# Altium schematic sheet ui-jetson-nano.SchDoc
size 420 x 297 mm; SheetNumber: 4; SheetTotal: 14
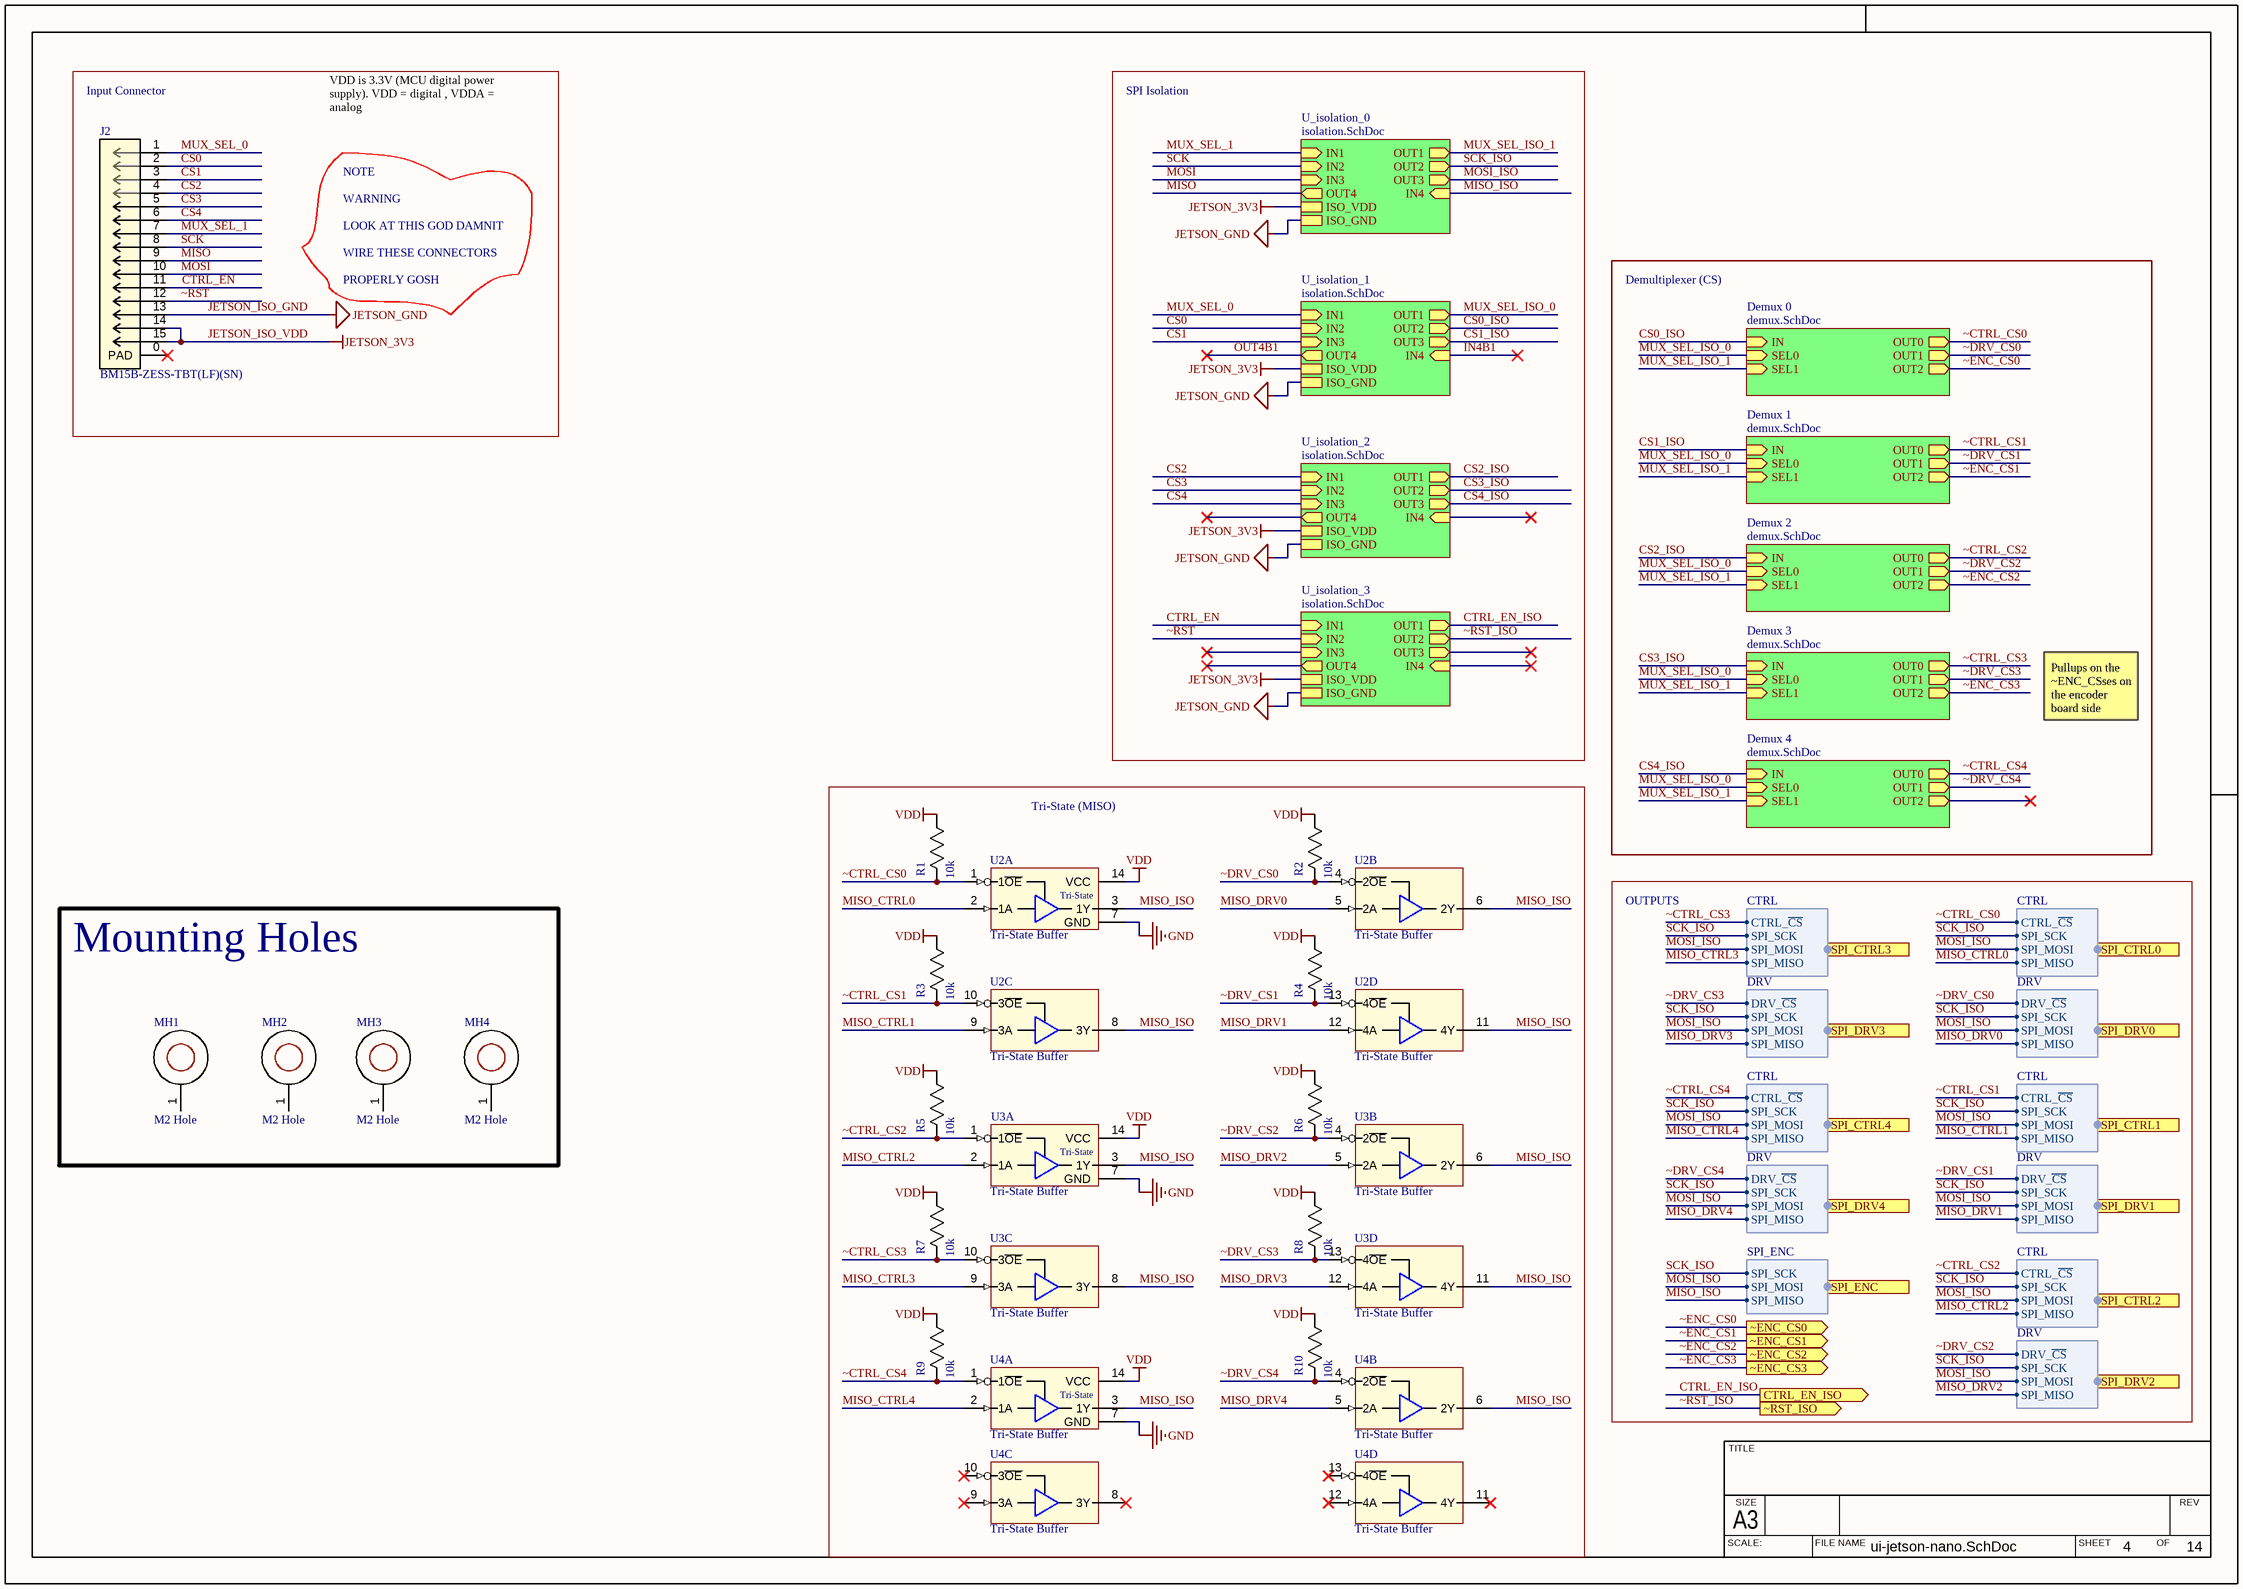
[diagram p0: ui-jetson-nano.SchDoc]

## Parts
J2  BM15B-ZESS-TBT(LF)(SN)  [JST ZE SMT 15POS]
MH1  M2 Hole  [Mounting Hole M2]  (no BOM)
MH2  M2 Hole  [Mounting Hole M2]  (no BOM)
MH3  M2 Hole  [Mounting Hole M2]  (no BOM)
MH4  M2 Hole  [Mounting Hole M2]  (no BOM)
R1  10k  [0603]
R2  10k  [0603]
R3  10k  [0603]
R4  10k  [0603]
R5  10k  [0603]
R6  10k  [0603]
R7  10k  [0603]
R8  10k  [0603]
R9  10k  [0603]
R10  10k  [0603]
U2  Tri-State Buffer  [14-TSSOP]  (parts A,B,C,D of 4)
U3  Tri-State Buffer  [14-TSSOP]  (parts A,B,C,D of 4)
U4  Tri-State Buffer  [14-TSSOP]  (parts A,B,C,D of 4)

## Blocks framed on the sheet
Tri-State (MISO): R1-R10 U2-U4
Mounting Holes: MH1-MH4

## Sub-sheets
Demux 0 = demux.SchDoc: IN (in), SEL0 (in), SEL1 (in), OUT1 (out), OUT2 (out), OUT0 (out)
Demux 1 = demux.SchDoc: IN (in), SEL0 (in), SEL1 (in), OUT1 (out), OUT2 (out), OUT0 (out)
Demux 2 = demux.SchDoc: IN (in), SEL0 (in), SEL1 (in), OUT1 (out), OUT2 (out), OUT0 (out)
Demux 3 = demux.SchDoc: IN (in), SEL0 (in), SEL1 (in), OUT1 (out), OUT2 (out), OUT0 (out)
Demux 4 = demux.SchDoc: IN (in), SEL0 (in), SEL1 (in), OUT1 (out), OUT2 (out), OUT0 (out)
U_isolation_0 = isolation.SchDoc: OUT1 (out), IN1 (in), IN2 (in), IN3 (in), OUT4 (out), OUT3 (out), OUT2 (out), IN4 (in), ISO_VDD, ISO_GND
U_isolation_1 = isolation.SchDoc: OUT1 (out), IN1 (in), IN2 (in), IN3 (in), OUT4 (out), OUT3 (out), OUT2 (out), IN4 (in), ISO_VDD, ISO_GND
U_isolation_2 = isolation.SchDoc: OUT1 (out), IN1 (in), IN2 (in), IN3 (in), OUT4 (out), OUT3 (out), OUT2 (out), IN4 (in), ISO_VDD, ISO_GND
U_isolation_3 = isolation.SchDoc: OUT1 (out), IN1 (in), IN2 (in), IN3 (in), OUT4 (out), OUT3 (out), OUT2 (out), IN4 (in), ISO_VDD, ISO_GND

## Ports
CTRL_EN_ISO (out), SPI_CTRL0 (harness CTRL), SPI_CTRL1 (harness CTRL), SPI_CTRL2 (harness CTRL), SPI_CTRL3 (harness CTRL), SPI_CTRL4 (harness CTRL), SPI_DRV0 (harness DRV), SPI_DRV1 (harness DRV), SPI_DRV2 (harness DRV), SPI_DRV3 (harness DRV), SPI_DRV4 (harness DRV), SPI_ENC (harness SPI_ENC), ~ENC_CS0 (out), ~ENC_CS1 (out), ~ENC_CS2 (out), ~ENC_CS3 (out), ~RST_ISO (out)

## Harnesses
CTRL: SPI_SCK, SPI_MISO, SPI_MOSI, CTRL_~{CS}
DRV: SPI_SCK, SPI_MISO, SPI_MOSI, DRV_~{CS}
SPI_ENC: SPI_SCK, SPI_MISO, SPI_MOSI

## Nets
GND: U2.7(GND) U3.7(GND) U4.7(GND)
JETSON_ISO_GND: J2.13 ; sheet U_isolation_0/ISO_GND, sheet U_isolation_1/ISO_GND, sheet U_isolation_2/ISO_GND, sheet U_isolation_3/ISO_GND  [also labelled JETSON_GND]
JETSON_ISO_VDD: J2.14 J2.15 ; sheet U_isolation_0/ISO_VDD, sheet U_isolation_1/ISO_VDD, sheet U_isolation_2/ISO_VDD, sheet U_isolation_3/ISO_VDD  [also labelled JETSON_3V3]
VDD: R1.1(R1) R2.1(R1) R3.1(R1) R4.1(R1) R5.1(R1) R6.1(R1) R7.1(R1) R8.1(R1) R9.1(R1) R10.1(R1) U2.14(VCC) U3.14(VCC) U4.14(VCC)
CS0: J2.2 ; sheet U_isolation_1/IN2
CS0_ISO: sheet U_isolation_1/OUT2, sheet Demux 0/IN
CS1: J2.3 ; sheet U_isolation_1/IN3
CS1_ISO: sheet U_isolation_1/OUT3, sheet Demux 1/IN
CS2: J2.4 ; sheet U_isolation_2/IN1
CS2_ISO: sheet U_isolation_2/OUT1, sheet Demux 2/IN
CS3: J2.5 ; sheet U_isolation_2/IN2
CS3_ISO: sheet U_isolation_2/OUT2, sheet Demux 3/IN
CS4: J2.6 ; sheet U_isolation_2/IN3
CS4_ISO: sheet U_isolation_2/OUT3, sheet Demux 4/IN
CTRL_EN: J2.11 ; sheet U_isolation_3/IN1
CTRL_EN_ISO: port CTRL_EN_ISO, sheet U_isolation_3/OUT1
IN4B1: sheet U_isolation_1/IN4
MISO: J2.9 ; sheet U_isolation_0/OUT4
MISO_CTRL0: U2.2(1A) ; port SPI_CTRL0.SPI_MISO
MISO_CTRL1: U2.9(3A) ; port SPI_CTRL1.SPI_MISO
MISO_CTRL2: U3.2(1A) ; port SPI_CTRL2.SPI_MISO
MISO_CTRL3: U3.9(3A) ; port SPI_CTRL3.SPI_MISO
MISO_CTRL4: U4.2(1A) ; port SPI_CTRL4.SPI_MISO
MISO_DRV0: U2.5(2A) ; port SPI_DRV0.SPI_MISO
MISO_DRV1: U2.12(4A) ; port SPI_DRV1.SPI_MISO
MISO_DRV2: U3.5(2A) ; port SPI_DRV2.SPI_MISO
MISO_DRV3: U3.12(4A) ; port SPI_DRV3.SPI_MISO
MISO_DRV4: U4.5(2A) ; port SPI_DRV4.SPI_MISO
MISO_ISO: U2.3(1Y) U2.6(2Y) U2.8(3Y) U2.11(4Y) U3.3(1Y) U3.6(2Y) U3.8(3Y) U3.11(4Y) U4.3(1Y) U4.6(2Y) ; sheet U_isolation_0/IN4, port SPI_ENC.SPI_MISO
MOSI: J2.10 ; sheet U_isolation_0/IN3
MOSI_ISO: sheet U_isolation_0/OUT3, port SPI_CTRL0.SPI_MOSI, port SPI_DRV0.SPI_MOSI, port SPI_ENC.SPI_MOSI, port SPI_CTRL1.SPI_MOSI, port SPI_DRV1.SPI_MOSI, port SPI_CTRL2.SPI_MOSI, port SPI_DRV2.SPI_MOSI, port SPI_CTRL3.SPI_MOSI, port SPI_DRV3.SPI_MOSI, port SPI_CTRL4.SPI_MOSI, port SPI_DRV4.SPI_MOSI
MUX_SEL_0: J2.1 ; sheet U_isolation_1/IN1
MUX_SEL_1: J2.7 ; sheet U_isolation_0/IN1
MUX_SEL_ISO_0: sheet U_isolation_1/OUT1, sheet Demux 0/SEL0, sheet Demux 1/SEL0, sheet Demux 2/SEL0, sheet Demux 3/SEL0, sheet Demux 4/SEL0
MUX_SEL_ISO_1: sheet U_isolation_0/OUT1, sheet Demux 0/SEL1, sheet Demux 1/SEL1, sheet Demux 2/SEL1, sheet Demux 3/SEL1, sheet Demux 4/SEL1
OUT4B1: sheet U_isolation_1/OUT4
SCK: J2.8 ; sheet U_isolation_0/IN2
SCK_ISO: sheet U_isolation_0/OUT2, port SPI_CTRL0.SPI_SCK, port SPI_DRV0.SPI_SCK, port SPI_ENC.SPI_SCK, port SPI_CTRL1.SPI_SCK, port SPI_DRV1.SPI_SCK, port SPI_CTRL2.SPI_SCK, port SPI_DRV2.SPI_SCK, port SPI_CTRL3.SPI_SCK, port SPI_DRV3.SPI_SCK, port SPI_CTRL4.SPI_SCK, port SPI_DRV4.SPI_SCK
~CTRL_CS0: R1.2(R2) U2.1(1~{OE}) ; sheet Demux 0/OUT0, port SPI_CTRL0.CTRL_~{CS}
~CTRL_CS1: R3.2(R2) U2.10(3~{OE}) ; sheet Demux 1/OUT0, port SPI_CTRL1.CTRL_~{CS}
~CTRL_CS2: R5.2(R2) U3.1(1~{OE}) ; sheet Demux 2/OUT0, port SPI_CTRL2.CTRL_~{CS}
~CTRL_CS3: R7.2(R2) U3.10(3~{OE}) ; sheet Demux 3/OUT0, port SPI_CTRL3.CTRL_~{CS}
~CTRL_CS4: R9.2(R2) U4.1(1~{OE}) ; sheet Demux 4/OUT0, port SPI_CTRL4.CTRL_~{CS}
~DRV_CS0: R2.2(R2) U2.4(2~{OE}) ; sheet Demux 0/OUT1, port SPI_DRV0.DRV_~{CS}
~DRV_CS1: R4.2(R2) U2.13(4~{OE}) ; sheet Demux 1/OUT1, port SPI_DRV1.DRV_~{CS}
~DRV_CS2: R6.2(R2) U3.4(2~{OE}) ; sheet Demux 2/OUT1, port SPI_DRV2.DRV_~{CS}
~DRV_CS3: R8.2(R2) U3.13(4~{OE}) ; sheet Demux 3/OUT1, port SPI_DRV3.DRV_~{CS}
~DRV_CS4: R10.2(R2) U4.4(2~{OE}) ; sheet Demux 4/OUT1, port SPI_DRV4.DRV_~{CS}
~ENC_CS0: port ~ENC_CS0, sheet Demux 0/OUT2
~ENC_CS1: port ~ENC_CS1, sheet Demux 1/OUT2
~ENC_CS2: port ~ENC_CS2, sheet Demux 2/OUT2
~ENC_CS3: port ~ENC_CS3, sheet Demux 3/OUT2
~RST: J2.12 ; sheet U_isolation_3/IN2
~RST_ISO: port ~RST_ISO, sheet U_isolation_3/OUT2

Not connected (* = marked no-connect by the designer): J2 0(PAD)*; MH1 1; MH2 1; MH3 1; MH4 1; U4 8(3Y)* 9(3A)* 10(3~{OE})* 11(4Y)* 12(4A)* 13(4~{OE})*

## Notes on the sheet
- Input Connector
- SPI Isolation
- VDD is 3.3V (MCU digital power supply). VDD = digital , VDDA = analog
- NOTE
- WARNING
- LOOK AT THIS GOD DAMNIT
- WIRE THESE CONNECTORS
- PROPERLY GOSH
- Demultiplexer (CS)
- Pullups on the ~ENC_CSses on the encoder board side
- OUTPUTS
- TITLE
- SCALE:
- A3
- SIZE
- FILE NAME
- SHEET
- OF
- REV
- (in symbol SN74LVC125APWR, part A) Tri-State

## Library data of the parts
J2 = CN 15POS JST ZE SMT: CONN HEADER VERT SMD 15POS ZE; Supplier 1: Digi-Key; Supplier Part Number 1: 455-4211-1-ND; Part Number: CN 15POS JST ZE SMT; Supplier URL 1: https://www.digikey.ca/en/products/detail/jst-sales-america-inc/BM15B-ZESS-TBT-LF-SN/1886999?s=N4IgTCBcDaIEIFkCMBWOBaAWgUQMq-QBU5CAKAGQDEBKU3AOWpAF0BfIA; Pin Count: 15; Manufacturer Part Number 1: BM15B-ZESS-TBT(LF)(SN)
MH1-MH4 = MOUNTING HOLE M2: Standard M2 Mounting Hole for M2 Standoff; Part Number: MOUNTING HOLE M2
R1-R10 = RES 10k 1/8W 1%: RES SMD 10K OHM 1% 1/8W 0805; Manufacturer Part Number 1: ERJ-H3GJ103V; Power (Watts): 0.125W; Tolerance: 5%; Package: 0805; Value: 10k; Part Number: RES 10k 1/8W 1%; Supplier 1: Digi-Key; Supplier Part Number 1: 10-ERJ-H3GJ103VCT-ND; Manufacturer Part Number 2: RMCF0805JT10K0; Supplier 2: Digi-Key; Supplier Part Number 2: RMCF0805JT10K0CT-ND; Tolerance 2: 5%; Supplier URL 1: https://www.digikey.ca/en/products/detail/panasonic-electronic-components/ERJ-H3GJ103V/13877876?s=N4IgTCBcDaIIwAYC0BRASgKSQCQMwHENFcA1AYQBUkA5AERAF0BfIA; Supplier URL 2: https://www.digikey.ca/en/products/detail/stackpole-electronics-inc/RMCF0805JT10K0/1757762?s=N4IgTCBcDaIEoFkDCAxADADjQVgFIBUBGNAaTSXxAF0BfIA
U2-U4 = SN74LVC125APWR: Buffer, Non-Inverting 4 Element 1 Bit per Element 3-State Output 14-TSSOP; Part Number: SN74LVC125APWR; Supplier 1: Digi-Key; Supplier Part Number 1: 296-1222-1-ND; Supplier URL 1: https://www.digikey.ca/en/products/detail/texas-instruments/SN74LVC125APWR/276865; Manufacturer Part Number 1: SN74LVC125APWR